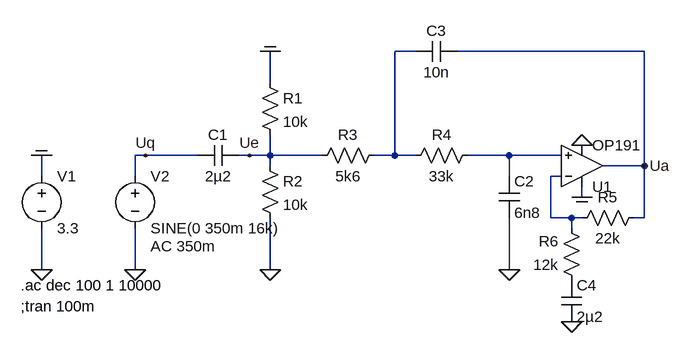
[diagram p0: schematic SallenKey-Redesign.asc]
SallenKey-Redesign.asc, the LTspice schematic file:
Version 4
SHEET 1 1252 680
WIRE 480 16 448 16
WIRE 832 16 544 16
WIRE 256 64 256 16
WIRE 64 176 48 176
WIRE 144 176 64 176
WIRE 224 176 208 176
WIRE 256 176 256 144
WIRE 256 176 224 176
WIRE 336 176 256 176
WIRE 448 176 448 16
WIRE 448 176 416 176
WIRE 480 176 448 176
WIRE 624 176 560 176
WIRE 704 176 624 176
WIRE 256 192 256 176
WIRE 832 192 832 16
WIRE 832 192 768 192
WIRE -96 208 -96 176
WIRE 48 208 48 176
WIRE 624 208 624 176
WIRE 704 208 688 208
WIRE 736 240 736 224
WIRE 688 272 688 208
WIRE 720 272 688 272
WIRE 736 272 720 272
WIRE 832 272 832 192
WIRE 832 272 816 272
WIRE 720 288 720 272
WIRE -96 352 -96 288
WIRE 48 352 48 288
WIRE 256 352 256 272
WIRE 624 352 624 272
FLAG -96 352 0
FLAG 48 352 0
FLAG 256 352 0
FLAG -96 176 COM
FLAG 256 16 COM
FLAG 736 160 0
FLAG 736 240 COM
FLAG 224 176 Ue
FLAG 720 432 0
FLAG 624 352 0
FLAG 832 192 Ua
FLAG 64 176 Uq
DATAFLAG 48 192 ""
DATAFLAG 736 16 ""
SYMBOL voltage -96 192 R0
WINDOW 123 0 0 Left 0
WINDOW 39 0 0 Left 0
SYMATTR InstName V1
SYMATTR Value 3.3
SYMBOL voltage 48 192 R0
WINDOW 123 24 124 Left 2
WINDOW 39 0 0 Left 0
SYMATTR Value2 AC 350m
SYMATTR InstName V2
SYMATTR Value SINE(0 350m 16k)
SYMBOL cap 208 160 R90
WINDOW 0 0 32 VBottom 2
WINDOW 3 32 32 VTop 2
SYMATTR InstName C1
SYMATTR Value 2µ2
SYMBOL res 240 48 R0
SYMATTR InstName R1
SYMATTR Value 10k
SYMBOL res 240 176 R0
SYMATTR InstName R2
SYMATTR Value 10k
SYMBOL res 432 160 R90
WINDOW 0 0 56 VBottom 2
WINDOW 3 32 56 VTop 2
SYMATTR InstName R3
SYMATTR Value 5k6
SYMBOL res 576 160 R90
WINDOW 0 0 56 VBottom 2
WINDOW 3 32 56 VTop 2
SYMATTR InstName R4
SYMATTR Value 33k
SYMBOL cap 608 208 R0
SYMATTR InstName C2
SYMATTR Value 6n8
SYMBOL cap 544 0 R90
WINDOW 0 0 32 VBottom 2
WINDOW 3 32 32 VTop 2
SYMATTR InstName C3
SYMATTR Value 10n
SYMBOL OpAmps\\OP191 736 256 M180
SYMATTR InstName U1
SYMBOL res 832 256 R90
WINDOW 0 0 56 VBottom 2
WINDOW 3 32 56 VTop 2
SYMATTR InstName R5
SYMATTR Value 22k
SYMBOL res 736 384 R180
WINDOW 0 36 76 Left 2
WINDOW 3 36 40 Left 2
SYMATTR InstName R6
SYMATTR Value 12k
SYMBOL cap 704 368 R0
SYMATTR InstName C4
SYMATTR Value 2µ2
TEXT -128 376 Left 2 !.ac dec 100 1 10000
TEXT -128 408 Left 2 !;tran 100m

The netlist it stands for:
* SallenKey-Redesign.asc
V1 COM 0 3.3
V2 Uq 0 SINE(0 350m 16k) AC 350m
C1 Ue Uq 2µ2
R1 COM Ue 10k
R2 Ue 0 10k
R3 N001 Ue 5k6
R4 N002 N001 33k
C2 N002 0 6n8
C3 Ua N001 10n
XU1 N002 N003 COM 0 Ua OP191  ; pins In+ In- V+ V- OUT
R5 Ua N003 22k
R6 P001 N003 12k
C4 P001 0 2µ2
.ac dec 100 1 10000
;tran 100m
.lib ADI.lib
.backanno
.end